# EAGLE schematic Spectra1 (EAGLE 8.0.1)
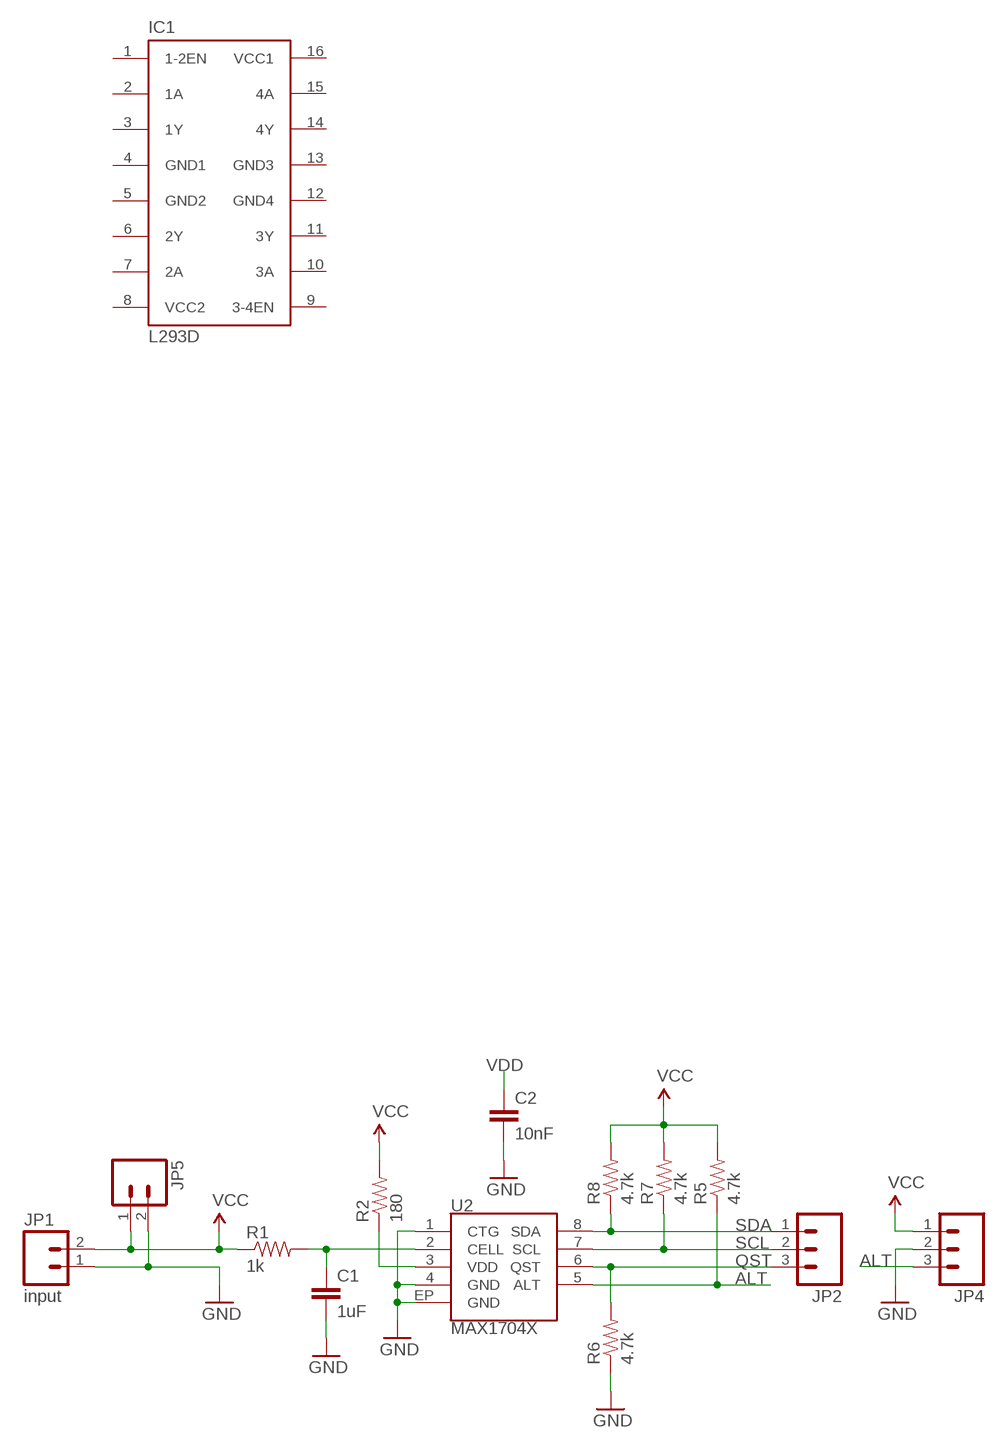
[diagram p0: schematic, sheet 1, part 1 of 2]
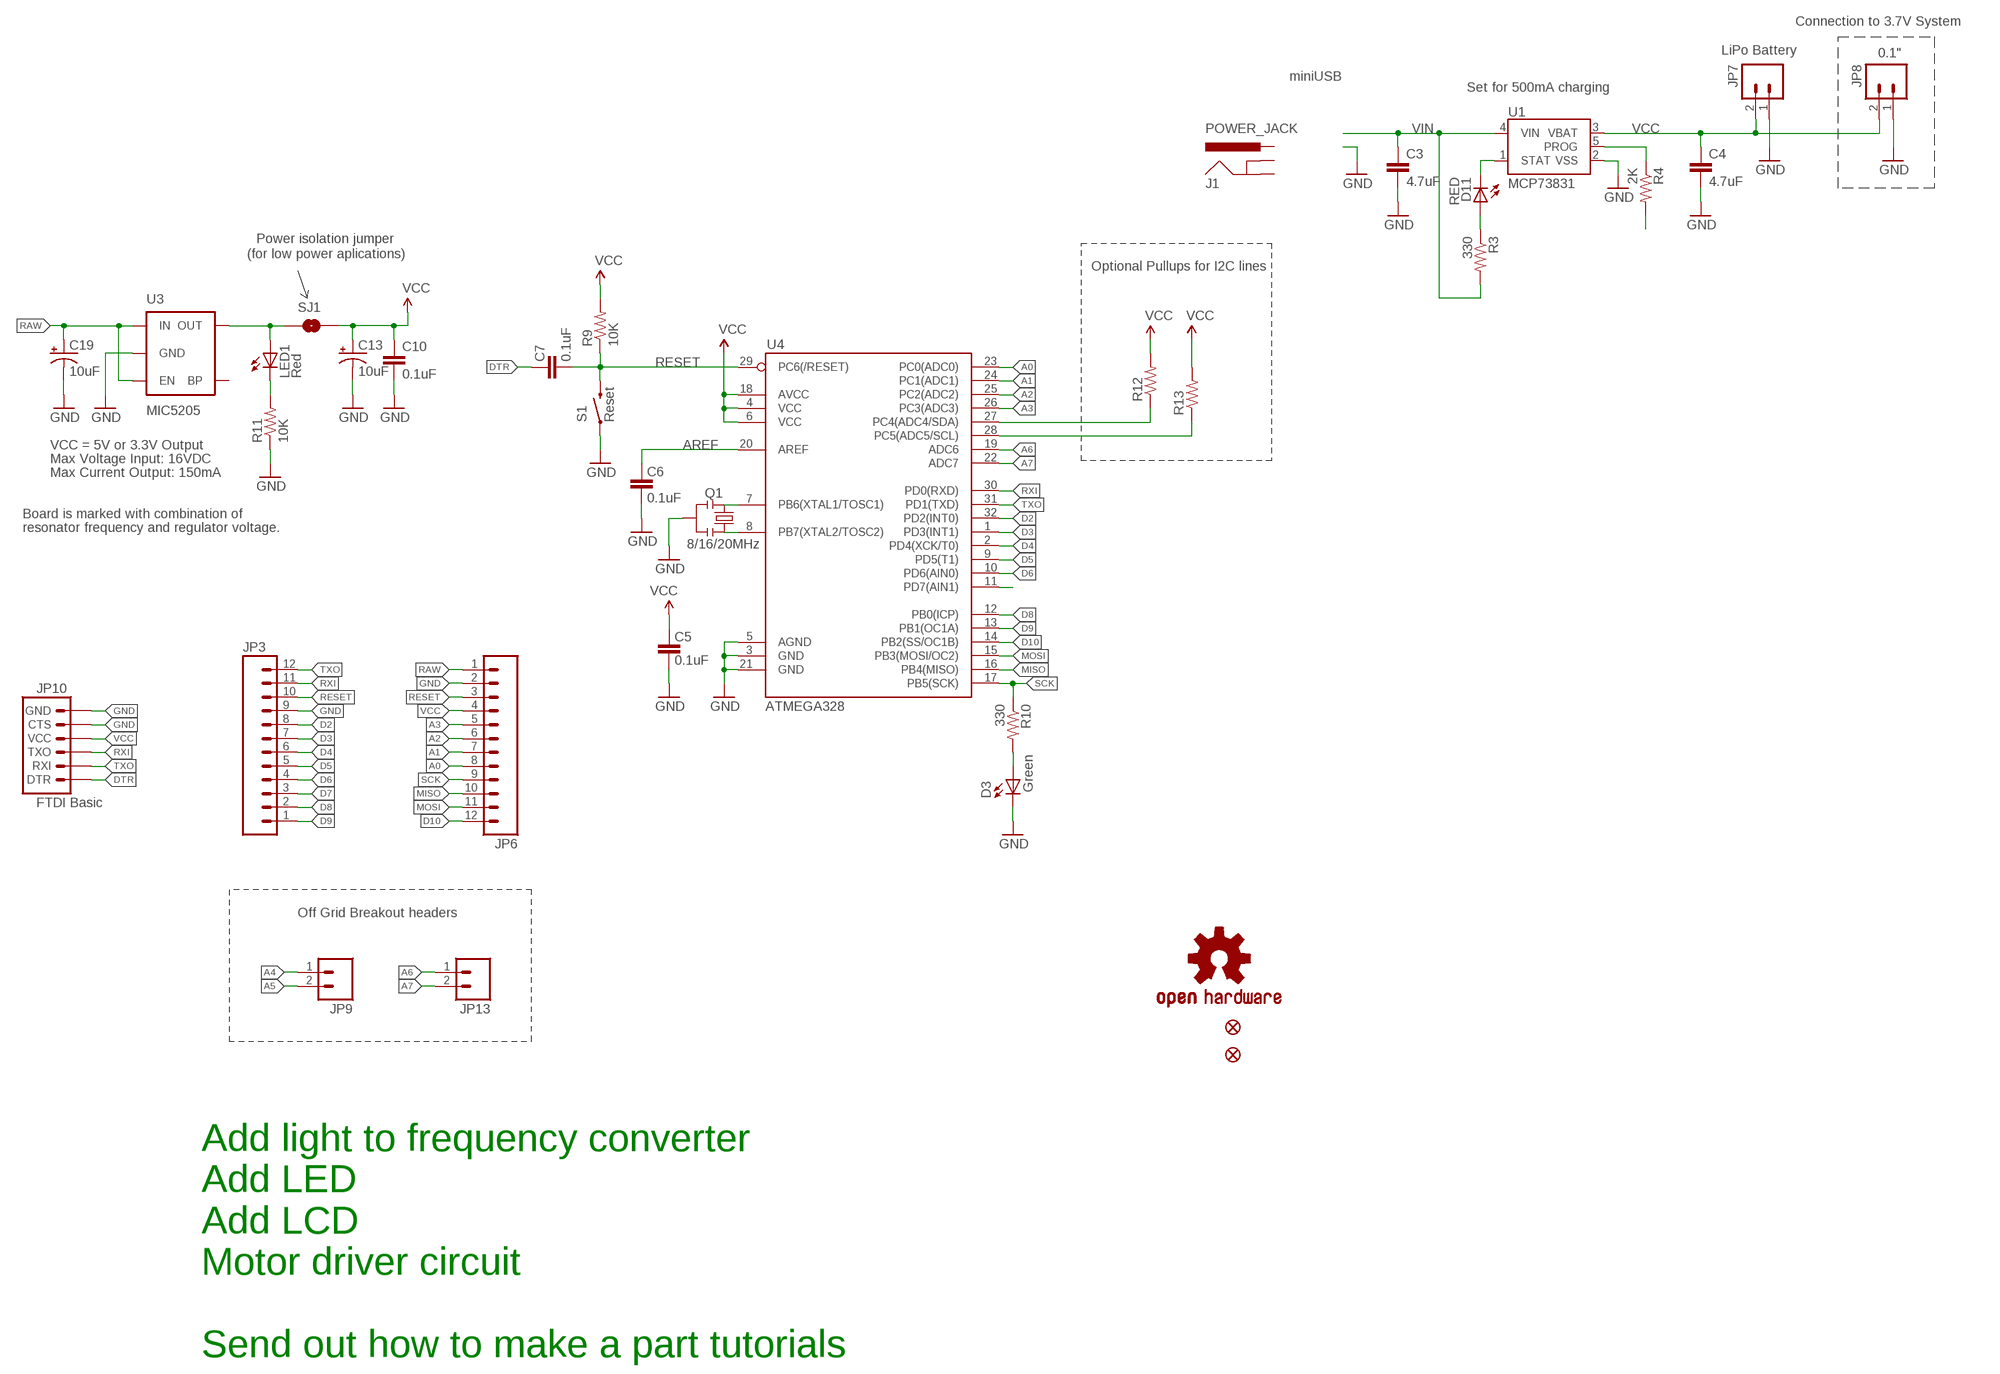
[diagram p1: schematic, sheet 1, part 2 of 2]

## Parts
C1  1uF  CAP0402-CAP  [0402-CAP]
C2  10nF  CAP0402-CAP  [0402-CAP]
C3  4.7uF  CAP0402-CAP  [0402-CAP]
C4  4.7uF  CAP0402-CAP  [0402-CAP]
C5  0.1uF  CAP0603-CAP  [0603-CAP]
C6  0.1uF  CAP0603-CAP  [0603-CAP]
C7  0.1uF  CAP0603-CAP  [0603-CAP]
C10  0.1uF  CAP0603-CAP  [0603-CAP]
C13  10uF  CAP_POL1206  [EIA3216]
C19  10uF  CAP_POL1206  [EIA3216]
D3  Green  LED  [0603-LED-ALT1]
D11  RED  LED0603  [LED-0603]
IC1  L293D  [DIL16]
J1  POWER_JACK  [POWER_JACK_PTH]
JP1  input  M02-JST-2MM-SMT  [JST-2-SMD]
JP2  M03PTH  [1X03]
JP3  M12PTH  [1X12]
JP4  M03PTH  [1X03]
JP5  M02PTH  [1X02]
JP6  M12PTH  [1X12]
JP7  LiPo Battery  M02-JST-2MM-SMT  [JST-2-SMD]
JP8  M02PTH  [1X02]
JP9  M02PTH  [1X02]
JP10  FTDI Basic  ARDUINO_SERIAL_PROGRAMPTH  [1X06]
JP11  FIDUCIALUFIDUCIAL  [MICRO-FIDUCIAL]
JP12  FIDUCIALUFIDUCIAL  [MICRO-FIDUCIAL]
JP13  M02PTH  [1X02]
LED1  Red  LED  [0603-LED-ALT1]
Q1  8/16/20MHz  RESONATOR1:1  [RESONATOR-SMD-1:1]
R1  1k  RESISTOR0402-RES  [0402-RES]
R2  180  RESISTOR0402-RES  [0402-RES]
R3  330  RESISTOR0402-RES  [0402-RES]
R4  2K  RESISTOR0402-RES  [0402-RES]
R5  4.7k  RESISTOR0402-RES  [0402-RES]
R6  4.7k  RESISTOR0402-RES  [0402-RES]
R7  4.7k  RESISTOR0402-RES  [0402-RES]
R8  4.7k  RESISTOR0402-RES  [0402-RES]
R9  10K  RESISTOR0603-RES  [0603-RES]
R10  330  RESISTOR0603-RES  [0603-RES]
R11  10K  RESISTOR0603-RES  [0603-RES]
R12  RESISTOR0603-RES  [0603-RES]
R13  RESISTOR0603-RES  [0603-RES]
S1  Reset  SWITCH-MOMENTARY-2SMD-ALT01  [TACTILE-SWITCH-SMD-ALT01]
SJ1  SOLDERJUMPERNC  [SJ_2S]
U1  MCP73831  [SOT23-5]
U2  MAX1704X  [TDFN-8]
U3  MIC5205  V_REG_LDOSMD  [SOT23-5]
U4  ATMEGA328  ATMEGA168  [TQFP32-08]
U$3  OSHW-LOGOS  [OSHW-LOGO-S]

## Nets
A0: JP6.8 U4.23(PC0(ADC0))
A1: JP6.7 U4.24(PC1(ADC1))
A2: JP6.6 U4.25(PC2(ADC2))
A3: JP6.5 U4.26(PC3(ADC3))
A4: JP9.1 R12.1 U4.27(PC4(ADC4/SDA))
A5: JP9.2 R13.1 U4.28(PC5(ADC5/SCL))
A6: JP13.1 U4.19(ADC6)
A7: JP13.2 U4.22(ADC7)
ALT: JP4.3 R5.1 U2.5(ALT)
AREF: C6.2 U4.20(AREF)
CHRG.CTRL: R4.2 U4.11(PD7(AIN1))
D2: JP3.8 U4.32(PD2(INT0))
D3: JP3.7 U4.1(PD3(INT1))
D4: JP3.6 U4.2(PD4(XCK/T0))
D5: JP3.5 U4.9(PD5(T1))
D6: JP3.4 U4.10(PD6(AIN0))
D7: JP3.3
D8: JP3.2 U4.12(PB0(ICP))
D9: JP3.1 U4.13(PB1(OC1A))
D10: JP6.12 U4.14(PB2(SS/OC1B))
DTR: C7.2 JP10.1(DTR)
GND: C1.2 C2.2 C3.2 C4.2 C5.1 C6.1 C10.2 C13.C(-) C19.C(-) D3.C JP1.1 JP3.9 JP4.2 JP5.2 JP6.2 JP7.1 JP8.1 JP10.5(CTS) JP10.6(GND) Q1.2 R6.1 R11.1 S1.1 S1.2 U1.2(VSS) U2.1(CTG) U2.4(GND) U2.EP(GND) U3.2(GND) U4.3(GND) U4.5(AGND) U4.21(GND)
MISO: JP6.10 U4.16(PB4(MISO))
MOSI: JP6.11 U4.15(PB3(MOSI/OC2))
N$1: Q1.3 U4.8(PB7(XTAL2/TOSC2))
N$2: C1.1 R1.2 U2.2(CELL)
N$3: D11.A R3.1
N$4: Q1.1 U4.7(PB6(XTAL1/TOSC1))
N$5: LED1.A SJ1.1 U3.5(OUT)
N$6: LED1.C R11.2
N$7: D3.A R10.2
PROG: R4.1 U1.5(PROG)
QST: JP2.3 R6.2 U2.6(QST)
RAW [vcc]: C19.A(+) JP6.1 U3.1(IN) U3.3(EN)
RESET: C7.1 JP3.10 JP6.3 R9.1 S1.3 S1.4 U4.29(PC6(/RESET))
RXI: JP3.11 JP10.3(TXO) U4.30(PD0(RXD))
SCK: JP6.9 R10.1 U4.17(PB5(SCK))
SCL: JP2.2 R7.1 U2.7(SCL)
SDA: JP2.1 R8.1 U2.8(SDA)
STAT: D11.C U1.1(STAT)
TXO: JP3.12 JP10.2(RXI) U4.31(PD1(TXD))
VCC: C4.1 C5.2 C10.1 C13.A(+) JP1.2 JP4.1 JP5.1 JP6.4 JP7.2 JP8.2 JP10.4(VCC) R1.1 R2.2 R5.2 R7.2 R8.2 R9.2 R12.2 R13.2 SJ1.2 U1.3(VBAT) U4.4(VCC) U4.6(VCC) U4.18(AVCC)
VDD: C2.1 R2.1 U2.3(VDD)
VIN: C3.1 R3.2 U1.4(VIN)
Unconnected: IC1.1(1-2EN) IC1.2(1A) IC1.3(1Y) IC1.6(2Y) IC1.7(2A) IC1.9(3-4EN) IC1.10(3A) IC1.11(3Y) IC1.14(4Y) IC1.15(4A) J1.GND J1.GNDBREAK J1.PWR U3.4(BP)

## Notes on the sheet
- Connection to 3.7V System
- 0.1"
- miniUSB
- Set for 500mA charging
- Power isolation jumper
- (for low power aplications)
- Optional Pullups for I2C lines
- VCC = 5V or 3.3V Output
- Max Voltage Input: 16VDC
- Max Current Output: 150mA
- Board is marked with combination of
- resonator frequency and regulator voltage.
- Off Grid Breakout headers
- Add light to frequency converter
  Add LED
  Add LCD
  Motor driver circuit
  
  Send out how to make a part tutorials

## Power pins joined to a net without a drawn wire
GND1: IC1.4(GND1)
GND2: IC1.5(GND2)
GND3: IC1.13(GND3)
GND4: IC1.12(GND4)
VCC1: IC1.16(VCC1)
VCC2: IC1.8(VCC2)

## Library data of the parts
C1-C7 C10 = SparkFun:CAP: Capacitor Standard 0603 ceramic capacitor, and 0.1" leaded capacitor.
C13 C19 = SparkFun:CAP_POL: Capacitor Polarized These are standard SMD and PTH capacitors. Normally 10uF, 47uF, and 100uF in electrolytic and tantalum varieties. Always verify the external diameter of the through hole cap, it varies with capacity, voltage, and manufacturer. The EIA devices should be standard.
D3 LED1 = Testing:LED: LEDs Standard schematic elements and footprints for 5mm, 3mm, 1206, and 0603 sized LEDs. 5mm - Spark Fun Electronics SKU : COM-00529 (and others)
D11 = SparkFun:LED: LEDs Standard schematic elements and footprints for 5mm, 3mm, 1206, and 0603 sized LEDs. 5mm - Spark Fun Electronics SKU : COM-00529 (and others)
IC1 = st-microelectronics:L293D: PUSH-PULL 4 CHANNEL DRIVER; MPN: L293D; OC_FARNELL: 9589619; OC_NEWARK: 56P8249
J1 = SparkFun-Connectors:POWER_JACK: Power Jack Connector This is the standard 5.5mm barrel jack for power. The PTH is the most common, proven, reliable, footprint. The Slot footprint only works if the mill layer is transmitted to the PCB fab house so be warned. Here are the connectors we sell at SparkFun: DC Barrel Power Jack/Connector <https://www.sparkfun.com/products/119> (PRT-00119) DC Barrel Power Jack/Connector (SMD) <https://www.sparkfun.com/products/12748> (PRT-12748) DC Barrel Jack Adapter - Breadboard Compatible <https://www.sparkfun.com/products/10811> (PRT-10811) It is used on this SparkFun product (and many, many others): SparkFun RedBoard - Programmed with Arduino <https://www.sparkfun.com/products/12757> (DEV-12757) Also, if you need a mating power supply or connector, please check these out: Wall Adapter Power Supply - 9VDC 650mA <https://www.sparkfun.com/products/298> (TOL-00298) DC Barrel Jack Adapter - Male <https://www.sparkfun.com/products/10287> (PRT-10287); PROD_ID: CONN-08197
JP1 JP5 JP7-JP9 JP13 = SparkFun:M02: Header 2 Standard 2-pin 0.1" header. Use with straight break away headers (SKU : PRT-00116), right angle break away headers (PRT-00553), swiss pins (PRT-00743), machine pins (PRT-00117), and female headers (PRT-00115). Molex polarized connector foot print use with SKU : PRT-08233 with associated crimp pins and housings.
JP2 JP4 = SparkFun:M03: Header 3 Standard 3-pin 0.1" header. Use with straight break away headers (SKU : PRT-00116), right angle break away headers (PRT-00553), swiss pins (PRT-00743), machine pins (PRT-00117), and female headers (PRT-00115). Molex polarized connector foot print use with SKU : PRT-08232 with associated crimp pins and housings.
JP3 JP6 = SparkFun:M12: Header 12 Standard 12-pin 0.1" header. Use with straight break away headers (SKU : PRT-00116), right angle break away headers (PRT-00553), swiss pins (PRT-00743), machine pins (PRT-00117), and female headers (PRT-00115).
JP10 = SparkFun:ARDUINO_SERIAL_PROGRAM
JP11 JP12 = SparkFun:FIDUCIAL: Fiducial Alignment Points Various fiducial points for machine vision alignment.
Q1 = Testing:RESONATOR: Resonator Small SMD resonator. This is the itty bitty 10/20MHz resonators with built in caps. CSTCE10M0G55 and CSTCE20M0V53. Footprint for SMD has been used in SFE production for years, and does work okay. 1:1 is an attempt to get larger fillets on the sides so it will be easier to inspect these solders in our AOI machine. The pads have been minimized to match the actual metal under the resonator. To see this relation, it includes an image import of the bottom side of the component. Imported to scale on layer 200.
R1-R13 = SparkFun:RESISTOR: Resistor Basic schematic elements and footprints for 0603, 1206, and PTH resistors.
S1 = Testing:SWITCH-MOMENTARY-2: Various NO switches- pushbuttons, reed, etc
SJ1 = SparkFun-Passives:SOLDERJUMPER: Solder Jumper Standard SMD solder jumper. Used to automate production. Two varients : Normally Open and Normally Closed are the same, but have different paste layers. NC will have a large amount of paste and should jumper during reflow.
U1 = SparkFun:MCP73831: Microchip's MCP73831 Miniature single cell, fully integrated Li-Ion, Li-polymer charge management controller http://ww1.microchip.com/downloads/en/DeviceDoc/21984a.pdf
U2 = SparkFun:MAX1704X: MAX17043/MAX17044: Battery Fuel Guage (43 is 1cell, 44 is 2cell)
U3 = SparkFun:V_REG_LDO: Voltage Regulator LDO Standard 150mA LDO voltage regulator in SOT-23 layout. Micrel part MIC5205. BP (by-pass) pin is used to lower output noise with 470pF cap.
U4 = SparkFun:ATMEGA168
U$3 = SparkFun:OSHW-LOGO: Open Source Hardware Logo This logo indicates the piece of hardware it is found on incorporates a OSHW license and/or adheres to the definition of open source hardware found here: http://freedomdefined.org/OSHW

## Net classes
0 default: width 0.203 mm
1 vcc: width 0.254 mm